# EAGLE schematic Schema 2 (EAGLE 9.6.2)
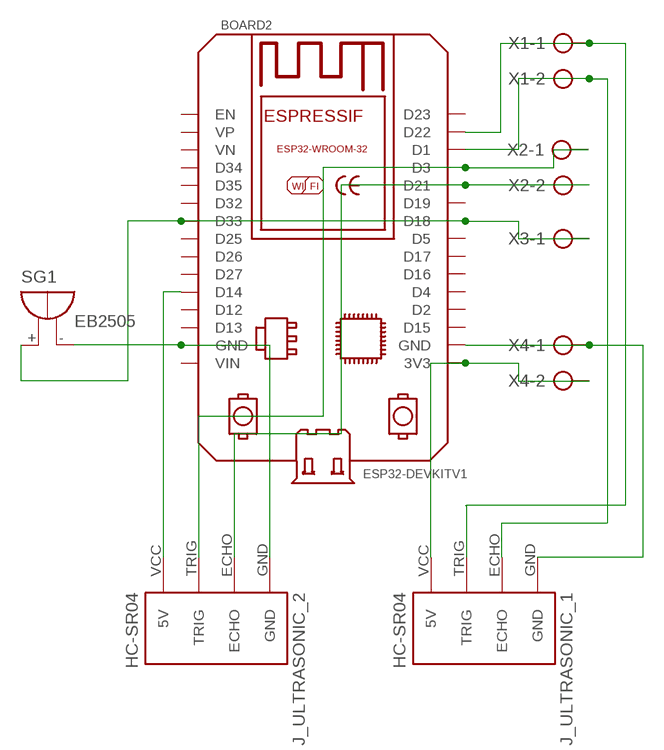
[diagram p0: schematic, sheet 1]

## Parts
BOARD2  ESP32DEVKITV1SHRIDATTDUDHAT  [ESP32-DEVKITV1]
J_ULTRASONIC_1  HC-SR04  [HC-SR04_FOOTPRINT]
J_ULTRASONIC_2  HC-SR04  [HC-SR04_FOOTPRINT]
SG1  EB2505  [EB2505]
X1  AK300/2  [AK300/2]
X2  AK300/2  [AK300/2]
X3  AK300/2  [AK300/2]
X4  AK300/2  [AK300/2]

## Nets
N$1: BOARD2.D22 J_ULTRASONIC_1.TRIG X1.1
N$2: BOARD2.D1 J_ULTRASONIC_1.ECHO X1.2
N$3: BOARD2.GND J_ULTRASONIC_2.GND SG1.-
N$4: BOARD2.D21 J_ULTRASONIC_2.ECHO X2.2
N$6: BOARD2.GND@1(GND) J_ULTRASONIC_1.GND X4.1
N$7: BOARD2.3V3 J_ULTRASONIC_1.VCC(5V) X4.2
N$8: BOARD2.D3 J_ULTRASONIC_2.TRIG X2.1
N$9: BOARD2.D14 J_ULTRASONIC_2.VCC(5V)
N$10: BOARD2.D18 BOARD2.D33 SG1.+ X3.1
Unconnected: BOARD2.D2 BOARD2.D4 BOARD2.D5 BOARD2.D12 BOARD2.D13 BOARD2.D15 BOARD2.D16 BOARD2.D17 BOARD2.D19 BOARD2.D23 BOARD2.D25 BOARD2.D26 BOARD2.D27 BOARD2.D32 BOARD2.D34 BOARD2.D35 BOARD2.EN BOARD2.VIN BOARD2.VN BOARD2.VP X3.2

## Library data of the parts
BOARD2 = ESP32-DEVKITV1:ESP32DEVKITV1: https://github.com/shridattdudhat
J_ULTRASONIC_1 J_ULTRASONIC_2 = Ultrasonic Sensor HC-SR04:HC-SR04: Ultrasonic Sensor HC-SR04
SG1 = buzzer:EB2505: BUZZER Source: Buerklin; OC_FARNELL: unknown; OC_NEWARK: unknown
X1-X4 = con-ptr500:AK300/2: CONNECTOR; OC_FARNELL: unknown; OC_NEWARK: unknown